# EAGLE design GDE043A2 FeatherWing (EAGLE 9.4.2)
COMPANY: ADAFRUIT INDUSTRIES; DRAWN: KTOWN; REV: B
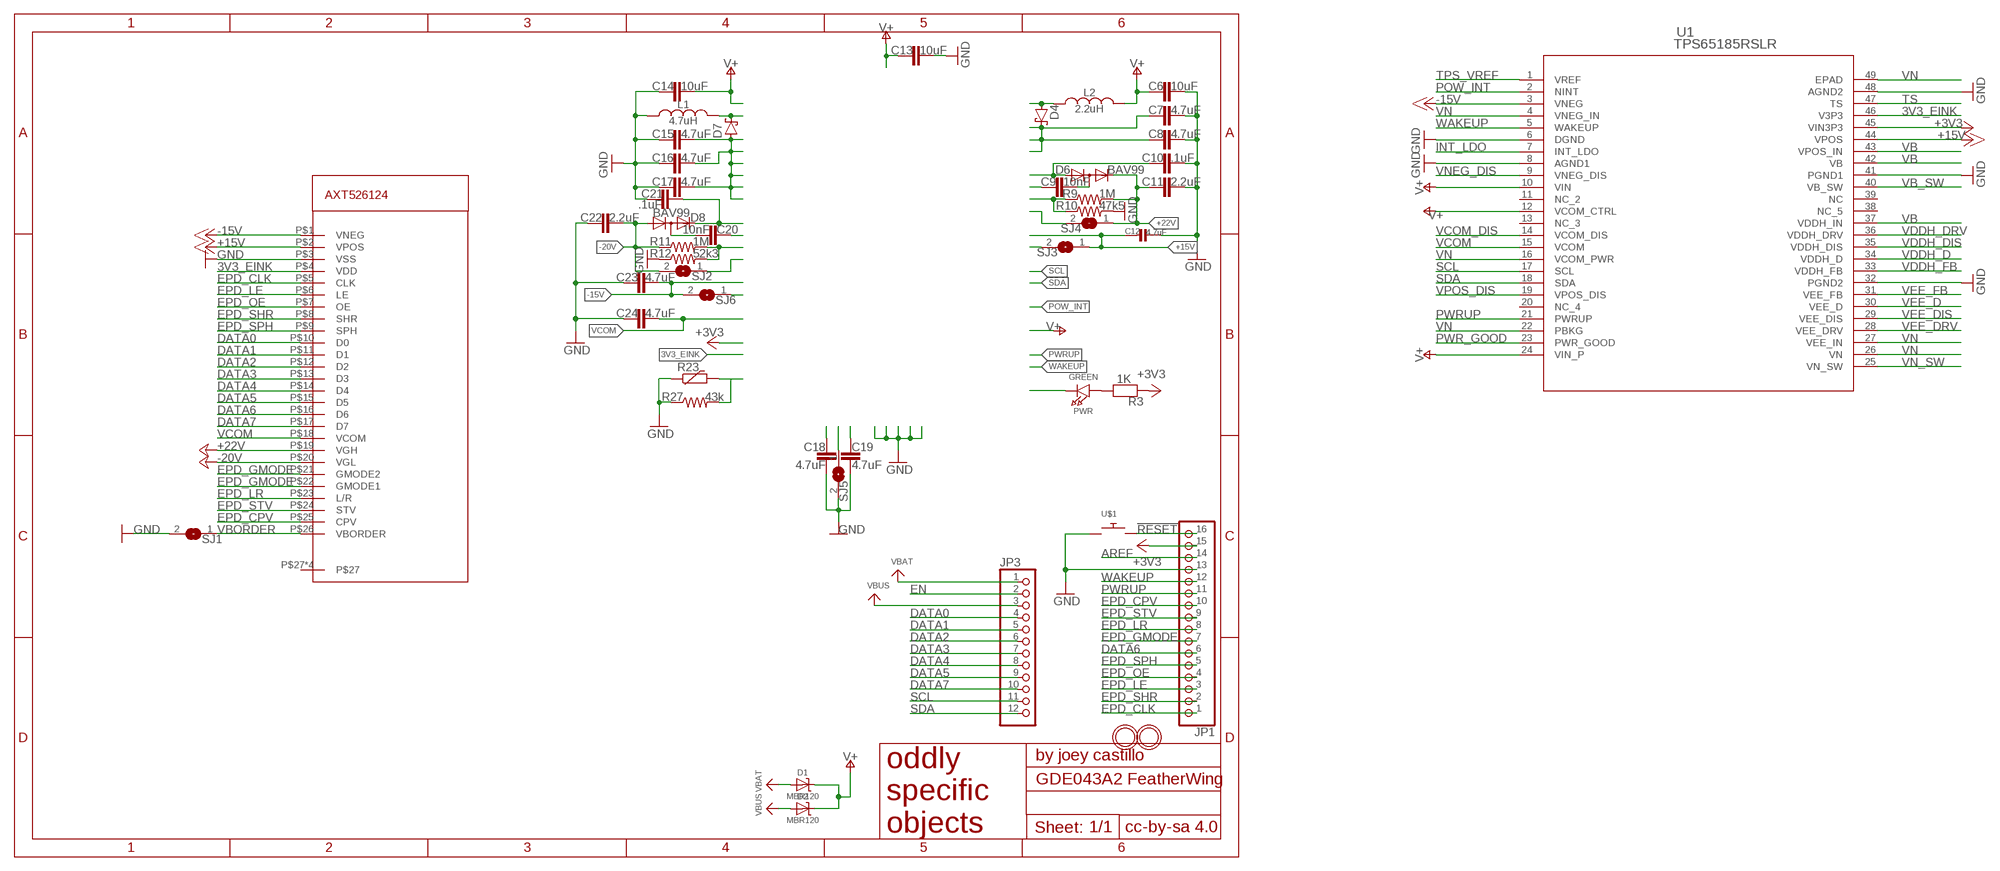
[diagram p0: schematic, sheet 1]

## Parts
C6  10uF  C-EUC0805K  [C0805K]
C7  4.7uF  C-EUC0805K  [C0805K]
C8  4.7uF  C-EUC0805K  [C0805K]
C9  10nF  C-EUC0805K  [C0805K]
C10  .1uF  C-EUC0805K  [C0805K]
C11  2.2uF  C-EUC0805K  [C0805K]
C12  4.7uF  CAP_CERAMIC0805_10MGAP  [0805_10MGAP]
C13  10uF  C-EUC0805K  [C0805K]
C14  10uF  C-EUC0805K  [C0805K]
C15  4.7uF  C-EUC0805K  [C0805K]
C16  4.7uF  C-EUC0805K  [C0805K]
C17  4.7uF  C-EUC0805K  [C0805K]
C18  4.7uF  C-EUC0805K  [C0805K]
C19  4.7uF  C-EUC0805K  [C0805K]
C20  10nF  C-EUC0805K  [C0805K]
C21  .1uF  C-EUC0805K  [C0805K]
C22  2.2uF  C-EUC0805K  [C0805K]
C23  4.7uF  C-EUC0805K  [C0805K]
C24  4.7uF  C-EUC0805K  [C0805K]
D1  MBR120  DIODE-SCHOTTKYSOD-123  [SOD-123]
D2  MBR120  DIODE-SCHOTTKYSOD-123  [SOD-123]
D4  MBR130T3G  [SOD123]
D6  BAV99  BAV199  [SOT23]
D7  MBR130T3G  [SOD123]
D8  BAV99  BAV199  [SOT23]
JP1  HEADER-1X16_MIN  [1X16_ROUND_MIN]
JP3  HEADER-1X12_MIN  [1X12_ROUND_MIN]
L1  4.7uH  NR4012  [NR4012]
L2  2.2uH  NR4012  [NR4012]
PWR  GREEN  LED0805_NOOUTLINE  [CHIPLED_0805_NOOUTLINE]
R3  1K  RESISTOR0805_NOOUTLINE  [0805-NO]
R9  1M  R-US_R0805  [R0805]
R10  47k5  R-US_R0805  [R0805]
R11  1M  R-US_R0805  [R0805]
R12  52k3  R-US_R0805  [R0805]
R23  R-EU_R0805  [R0805]
R27  43k  R-US_R0805  [R0805]
SJ1  SJ  [SJ]
SJ2  SJ  [SJ]
SJ3  SJ  [SJ]
SJ4  SJ  [SJ]
SJ5  SJ  [SJ]
SJ6  SJ  [SJ]
U1  TPS65185RSLR  [RSL48_4P4X4P4]
U$1  SPST_TACTILE_SWITCHTHRU-SECONDTRY  [MJTP1250-TRY2]
U$2  AXT526124  [AXT526124]
U$31  MOUNTINGHOLE2.5  [MOUNTINGHOLE_2.5_PLATED]
U$32  MOUNTINGHOLE2.5  [MOUNTINGHOLE_2.5_PLATED]

## Nets
3V3_EINK: U1.46(V3P3) U$2.P$4(VDD)
!RESET: JP1.16 U$1.P$2
+3V3 [power]: JP1.15 R3.1 U1.45(VIN3P3)
+15V: C12.2 SJ3.1 U1.44(VPOS) U$2.P$2(VPOS)
+22V: C11.1 D6.2(C) R9.2 SJ4.1 U$2.P$19(VGH)
-15V: C23.2 SJ6.2 U1.3(VNEG) U$2.P$1(VNEG)
-20V: C22.2 D8.1(A) R11.1 SJ2.2 U$2.P$20(VGL)
AREF: JP1.14
DATA0: JP3.4 U$2.P$10(D0)
DATA1: JP3.5 U$2.P$11(D1)
DATA2: JP3.6 U$2.P$12(D2)
DATA3: JP3.7 U$2.P$13(D3)
DATA4: JP3.8 U$2.P$14(D4)
DATA5: JP3.9 U$2.P$15(D5)
DATA6: JP1.6 U$2.P$16(D6)
DATA7: JP3.10 U$2.P$17(D7)
EN: JP3.2
EPD_CLK: JP1.1 U$2.P$5(CLK)
EPD_CPV: JP1.10 U$2.P$25(CPV)
EPD_GMODE: JP1.7 U$2.P$21(GMODE2) U$2.P$22(GMODE1)
EPD_LE: JP1.3 U$2.P$6(LE)
EPD_LR: JP1.8 U$2.P$23(L/R)
EPD_OE: JP1.4 U$2.P$7(OE)
EPD_SHR: JP1.2 U$2.P$8(SHR)
EPD_SPH: JP1.5 U$2.P$9(SPH)
EPD_STV: JP1.9 U$2.P$24(STV)
GND [gnd]: C6.2 C7.2 C8.2 C10.2 C11.2 C12.1 C13.2 C14.1 C15.1 C16.1 C17.1 C18.1 C19.1 C21.1 C22.1 C23.1 C24.1 JP1.13 L1.P$1 R10.2 R12.1 R23.1 R27.1 SJ1.2 SJ5.2 U1.6(DGND) U1.8(AGND1) U1.32(PGND2) U1.41(PGND1) U1.48(AGND2) U$1.P$1 U$2.P$3(VSS)
INT_LDO: C18.2 U1.7(INT_LDO)
N$2: PWR.A R3.2
N$21: C9.2 D6.3(AC)
N$23: C20.2 D8.3(AC)
POW_INT: U1.2(NINT)
PWR_GOOD: PWR.C U1.23(PWR_GOOD)
PWRUP: JP1.11 U1.21(PWRUP)
SCL: JP3.11 U1.17(SCL)
SDA: JP3.12 U1.18(SDA)
TPS_VREF: C19.2 U1.1(VREF)
TS: R23.2 R27.2 U1.47(TS)
V+ [power]: C6.1 C13.1 C14.2 D1.C D2.C L2.P$2 U1.10(VIN) U1.12(VCOM_CTRL) U1.24(VIN_P)
VB: C7.1 C8.1 D4.1(C) U1.37(VDDH_IN) U1.42(VB) U1.43(VPOS_IN)
VB_SW: D4.2(A) L2.P$1 U1.40(VB_SW)
VBAT [power]: D1.A JP3.1
VBORDER: SJ1.1 U$2.P$26(VBORDER)
VBUS [power]: D2.A JP3.3
VCOM: C24.2 U1.15(VCOM) U$2.P$18(VCOM)
VCOM_DIS: SJ5.1 U1.14(VCOM_DIS)
VDDH_D: C10.1 D6.1(A) U1.34(VDDH_D)
VDDH_DIS: SJ4.2 U1.35(VDDH_DIS)
VDDH_DRV: C9.1 U1.36(VDDH_DRV)
VDDH_FB: R9.1 R10.1 U1.33(VDDH_FB)
VEE_D: C21.2 D8.2(C) U1.30(VEE_D)
VEE_DIS: SJ2.1 U1.29(VEE_DIS)
VEE_DRV: C20.1 U1.28(VEE_DRV)
VEE_FB: R11.2 R12.2 U1.31(VEE_FB)
VN: C15.2 C16.2 C17.2 D7.2(A) U1.4(VNEG_IN) U1.16(VCOM_PWR) U1.22(PBKG) U1.26(VN) U1.27(VEE_IN) U1.49(EPAD)
VN_SW: D7.1(C) L1.P$2 U1.25(VN_SW)
VNEG_DIS: SJ6.1 U1.9(VNEG_DIS)
VPOS_DIS: SJ3.2 U1.19(VPOS_DIS)
WAKEUP: JP1.12 U1.5(WAKEUP)
Unconnected: U1.11(NC_2) U1.13(NC_3) U1.20(NC_4) U1.38(NC_5) U1.39(NC) U$2.P$27 U$2.P$28 U$2.P$29 U$2.P$30

## Library data of the parts
C6-C11 C13-C24 = rcl:C-EU: CAPACITOR, European symbol
C12 = microbuilder:CAP_CERAMIC: Ceramic Capacitors For new designs, use the packages preceded by an '_' character since they are more reliable: The following footprints should be used on most boards: _0402 - Standard footprint for regular board layouts _0603 - Standard footprint for regular board layouts _0805 - Standard footprint for regular board layouts _1206 - Standard footprint for regular board layouts For extremely tight-pitch boards where space is at a premium, the following 'micro-pitch' footprints can be used (smaller pads, no silkscreen outline, etc.): _0402MP - Micro-pitch footprint for very dense/compact boards _0603MP - Micro-pitch footprint for very dense/compact boards _0805MP - Micro-pitch footprint for very dense/compact boards _1206MP - Micro-pitch footprint for very dense/compact boards
D1 D2 = microbuilder:DIODE-SCHOTTKY
D4 D7 = aalectronics:MBR130T3G
D6 D8 = diode:BAV199: DIODE low-leakage double diode
JP1 = microbuilder:HEADER-1X16: PIN HEADER
JP3 = microbuilder:HEADER-1X12
L1 L2 = aalectronics:NR4012
PWR = microbuilder:LED: LED 0603 - 0603 Surface Mount Package 2mA: Green LED - Low Power (3.9mcd, 2ma, 1.7Vf) - Digikey: 475-2709-2-ND Orange LED - Low Power (9.8mcd, 2ma, 1.8Vf) - Digikey: 475-1194-2-ND Red LED - Low Power (5mcd, 2ma, 1.8Vf) - Digikey: 475-1195-2-ND Yellow LED - Low Power (7mcd, 2ma, 1.8Vf) - Digikey: 475-1196-2-ND 5mA: Blue LED - Low Power (17mcd, 5ma, 2.9Vf) - Digikey: LNJ937W8CRACT-ND 0805 - 0805 Surface Mount Package 2mA: Red LED (8.8mcd, 2mA, 1.8Vf, Clear) - Low Power [Digikey: 475-2510-1-ND] Green LED (5mcd, 2mA, 1.8Vf, Clear) - Low Power [Digikey: 475-2730-1-ND] Yellow LED (11.3mcd, 2mA, 1.8Vf, Clear) - Low Power [Digikey: 475-2555-1-ND] 20mA: Red LED (104mcd, 20mA, Diffused) - LS R976 [Digikey: 475-1278-6-ND] Red LED (12mcd, 20mA, 2.0Vf, Clear) - APT2012EC [Digikey: 754-1128-1-ND] Green LED (15mcd, 20mA, 2.2Vf, Clear) - APT2012GC [Digikey: 754-1131-1-ND] Orange LED (160mcd, 20mA, 2.1Vf, Clear) - APT2012SECK [Digikey: 754-1130-1-ND] 1206 - 1206 Surface Mount Package Green LED (26mcd, 20mA, Diffused) - LG N971 [Digikey: 475-1407-6-ND] Red LED (15mcd, 20mA, Diffused) - LH N974 [Digikey: 475-1416-6-ND] Cree - Cree High-Power Surface Mount LEDs XPEBWT-L1-0000-00D50 - White 111lm 350mA 2.9Vf 6200K 110° XTEAWT-00-0000-00000LEE3 - White 114lm 350mA 2.85Vf 5000K 115° Everlight - Everlight 45-21 Series Surface Mount LEDs 45-21/QK2C-B2832AC2CB2/2T - Warm White 2000mcd 20mA 3.25Vf 3050K 120° 45-21/LK2C-B38452C4CB2/2T - Nuetral White 2000mcd 20mA 3.25Vf 4150K 120° 45-21/LK2C-B50634C6CB2/2T - Cold White 2200mcd 20mA 3.25Vf 5650K 120° PLCC2 Reverse Mount LS T77K-J1L2-1-0-2-R18-Z - Red 11.25mcd 2mA 1.8Vf 630nm 120° LO T77K-L1M2-24-Z - Orange 19.6mcd 2mA 1.8Vf 606nm 120° LY T77K-K2M1-26-Z - Yellow 15.7mcd 2mA 1.8Vf 587nm 120°
R3 = microbuilder:RESISTOR: Resistors For new designs, use the packages preceded by an '_' character since they are more reliable: The following footprints should be used on most boards: _0402 - Standard footprint for regular board layouts _0603 - Standard footprint for regular board layouts _0805 - Standard footprint for regular board layouts _1206 - Standard footprint for regular board layouts For extremely tight-pitch boards where space is at a premium, the following 'micro-pitch' footprints can be used (smaller pads, no silkscreen outline, etc.): _0402MP - Micro-pitch footprint for very dense/compact boards _0603MP - Micro-pitch footprint for very dense/compact boards _0805MP - Micro-pitch footprint for very dense/compact boards _1206MP - Micro-pitch footprint for very dense/compact boards
R9-R12 R27 = rcl:R-US_: RESISTOR, American symbol
R23 = rcl:R-EU_: RESISTOR, European symbol
SJ1-SJ6 = jumper:SJ: SMD solder JUMPER
U1 = My Stuff:TPS65185RSLR; BUILT_BY: EMA_UL_Team; MANUFACTURER: Texas Instruments; MANUFACTURER_PART_NUMBER: TPS65185RSLR; VENDOR: Texas Instruments
U$1 = My Stuff:SPST_TACTILE_SWITCH
U$2 = My Stuff:AXT526124
U$31 U$32 = microbuilder:MOUNTINGHOLE: Mounting Hole For #2 screws (0.086"/2.18mm width, 0.094"/2.4mm hole) use 2.5mm; BOM: EXCLUDE

## Net classes
0 default: width 0.152 mm, drill 0.254 mm
1 power: width 0.279 mm, drill 0.305 mm
2 gnd: width 0.254 mm, drill 0.254 mm

## Board
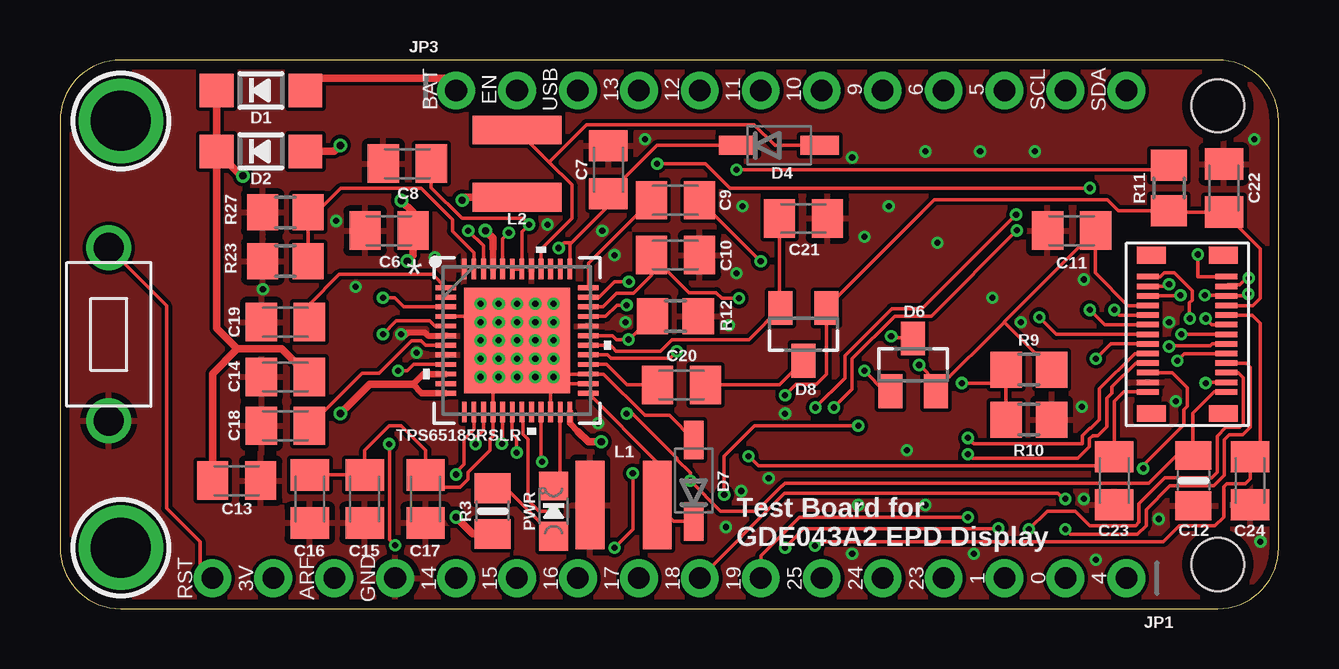
[diagram p1: board, top side]
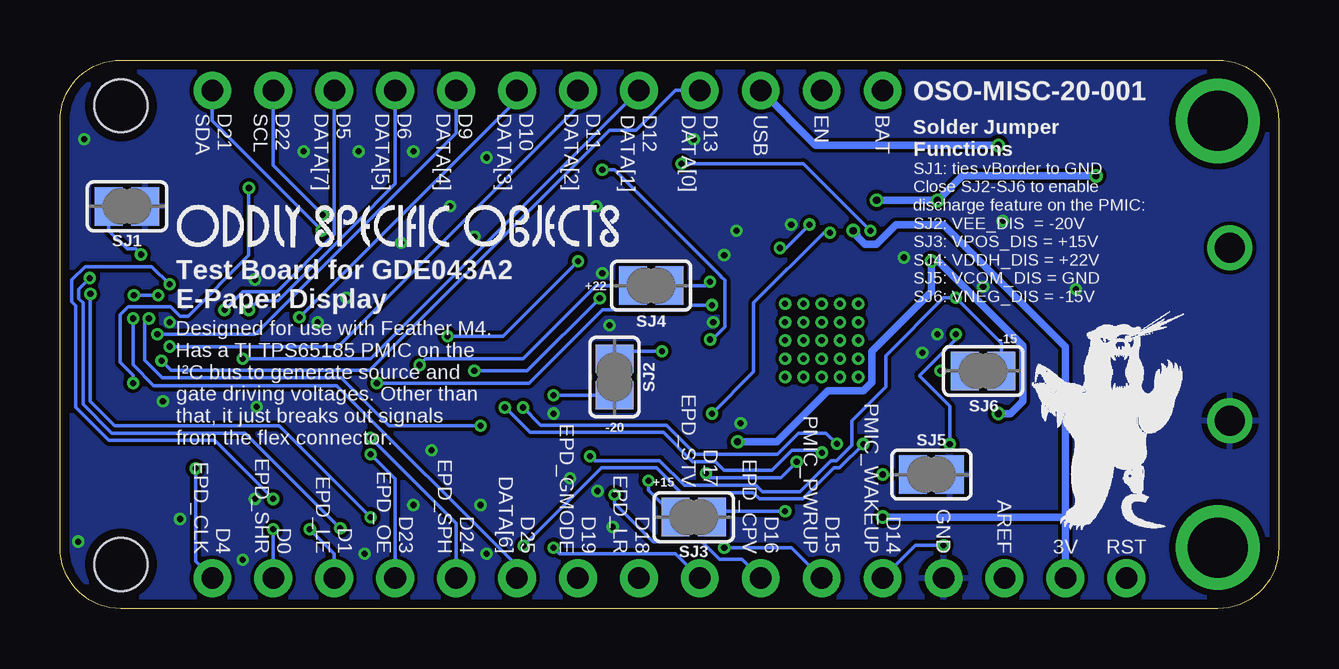
[diagram p2: board, bottom side, seen from below]

Size 50.8 x 22.86 mm. Coordinates in mm from the lower left corner, seen from the top.
Outline: 2.54,0 48.26,0 arc90 50.8,2.54 50.8,20.32 arc90 48.26,22.86 2.54,22.86 arc90 0,20.32 0,2.54 arc90 2.54,0
Copper layers (1*16): Top 0.035559375mm / dielectric 1.6mm / Bottom 0.035559375mm
Design rules "oshpark-2layer *": minimum track width 6mil, minimum drill 10mil, track to track 6mil, track to pad 6mil, pad to pad 6mil, via to via 6mil, smd to smd 6mil, copper to edge 15mil, drill to drill 6mil, minimum pad ring 5mil, minimum via ring 5mil, stop-mask expansion 2.5mil, vias tented up to drill 12mil, thermal gap 10mil
Holes 2.2 mm at 48.26,1.84 48.26,20.95

### Footprints (pad centres in the part's own frame; a part is rotated, then mirrored left to right if it is on the bottom)
C0805K = smd 1.3 x 1.6: 1 -1,0; 2 1,0
0805_10MGAP = smd 1.2 x 1.5: 1 -1.05,0; 2 1.05,0
SOD-123 = smd 1.4 x 1.4: A 1.85,0; C -1.85,0
SOD123 = smd 1.6 x 0.8: 1 -1.7,0; 2 1.7,0
SOT23 = smd 1 x 1.4: 1 -0.95,-1.1; 2 0.95,-1.1; 3 0,1.1
1X16_ROUND_MIN = drill 0.9 pad 1.575: 1 -19.05,0; 2 -16.51,0; 3 -13.97,0; 4 -11.43,0; 5 -8.89,0; 6 -6.35,0; 7 -3.81,0; 8 -1.27,0; 9 1.27,0; 10 3.81,0; 11 6.35,0; 12 8.89,0; 13 11.43,0; 14 13.97,0; 15 16.51,0; 16 19.05,0
1X12_ROUND_MIN = drill 0.9 pad 1.575: 1 -13.97,0; 2 -11.43,0; 3 -8.89,0; 4 -6.35,0; 5 -3.81,0; 6 -1.27,0; 7 1.27,0; 8 3.81,0; 9 6.35,0; 10 8.89,0; 11 11.43,0; 12 13.97,0
NR4012 = smd 1.2 x 3.7: P$1 -1.4,0; P$2 1.4,0
CHIPLED_0805_NOOUTLINE = smd 1.2 x 1.2: A 0,-1.05; C 0,1.05
0805-NO = smd 1.24 x 1.5: 1 -0.95,0; 2 0.95,0
R0805 = smd 1.3 x 1.5: 1 -0.95,0; 2 0.95,0
SJ = smd 1.168 x 1.6: 1 -0.762,0; 2 0.762,0
RSL48_4P4X4P4 = smd 0.85 x 0.2: 1 -2.975,2.2; 2 -2.975,1.8; 3 -2.975,1.4; 4 -2.975,1; 5 -2.975,0.6; 6 -2.975,0.2; 7 -2.975,-0.2; 8 -2.975,-0.6; 9 -2.975,-1; 10 -2.975,-1.4; 11 -2.975,-1.8; 12 -2.975,-2.2; 25 2.975,-2.2; 26 2.975,-1.8; 27 2.975,-1.4; 28 2.975,-1; 29 2.975,-0.6; 30 2.975,-0.2; 31 2.975,0.2; 32 2.975,0.6; 33 2.975,1; 34 2.975,1.4; 35 2.975,1.8; 36 2.975,2.2 | smd 0.2 x 0.85: 13 -2.2,-2.975; 14 -1.8,-2.975; 15 -1.4,-2.975; 16 -1,-2.975; 17 -0.6,-2.975; 18 -0.2,-2.975; 19 0.2,-2.975; 20 0.6,-2.975; 21 1,-2.975; 22 1.4,-2.975; 23 1.8,-2.975; 24 2.2,-2.975; 37 2.2,2.975; 38 1.8,2.975; 39 1.4,2.975; 40 1,2.975; 41 0.6,2.975; 42 0.2,2.975; 43 -0.2,2.975; 44 -0.6,2.975; 45 -1,2.975; 46 -1.4,2.975; 47 -1.8,2.975; 48 -2.2,2.975 | smd 4.4 x 4.4: 49 0,0 | drill 0.254 pad 0.508: P$1 -1.524,1.524; P$2 -0.762,1.524; P$3 0,1.524; P$4 0.762,1.524; P$5 1.524,1.524; P$6 -1.524,0.762; P$7 -0.762,0.762; P$8 0,0.762; P$9 0.762,0.762; P$10 1.524,0.762; P$11 -1.524,0; P$12 -0.762,0; P$13 0,0; P$14 0.762,0; P$15 1.524,0; P$16 -1.524,-0.762; P$17 -0.762,-0.762; P$18 0,-0.762; P$19 0.762,-0.762; P$20 1.524,-0.762; P$21 -1.524,-1.524; P$22 -0.762,-1.524; P$23 0,-1.524; P$24 0.762,-1.524; P$25 1.524,-1.524
MJTP1250-TRY2 = drill 1.25: P$1 -3.6,0; P$2 3.6,0
AXT526124 = smd 0.23 x 0.92: P$1 -2.4,1.65; P$2 -2.4,-1.63; P$3 -2,1.65; P$4 -2,-1.63; P$5 -1.6,1.65; P$6 -1.6,-1.63; P$7 -1.2,1.65; P$8 -1.2,-1.63; P$9 -0.8,1.65; P$10 -0.8,-1.63; P$11 -0.4,1.65; P$12 -0.4,-1.63; P$13 0,1.65; P$14 0,-1.63; P$15 0.4,1.65; P$16 0.4,-1.63; P$17 0.8,1.65; P$18 0.8,-1.63; P$19 1.2,1.65; P$20 1.2,-1.63; P$21 1.6,1.65; P$22 1.6,-1.63; P$23 2,1.65; P$24 2,-1.63; P$25 2.4,1.65; P$26 2.4,-1.63 | smd 0.7 x 1.2: P$27 -3.3,1.5; P$28 -3.3,-1.5; P$29 3.3,1.5; P$30 3.3,-1.5
MOUNTINGHOLE_2.5_PLATED = drill 2.5 pad 3.2: P$1 0,0

### Placement (x,y rotation side)
C6  13.72,15.75 180 top
C7  22.86,18.29 90 top
C8  14.48,18.54 180 top
C9  25.65,17.02 0 top
C10  25.65,14.73 0 top
C11  42.16,15.75 180 top
C12  47.24,5.33 90 top
C13  7.37,5.33 0 top
C14  9.4,9.65 0 top
C15  12.7,4.57 90 top
C16  10.41,4.57 90 top
C17  15.24,4.57 90 top
C18  9.4,7.62 0 top
C19  9.4,11.94 0 top
C20  25.91,9.32 0 top
C21  30.99,16.26 180 top
C22  48.51,17.53 270 top
C23  43.94,5.33 90 top
C24  49.61,5.33 90 top
D1  8.38,21.59 0 top
D2  8.38,19.05 0 top
D4  29.97,19.3 0 top
D6  35.56,10.16 0 top
D7  26.42,5.33 90 top
D8  30.99,11.43 180 top
JP1  25.4,1.27 180 top
JP3  30.48,21.59 0 top
L1  23.5,4.32 0 top
L2  19.05,18.54 270 top
PWR  20.57,4.06 0 top
R3  18.03,4.06 90 top
R9  40.39,9.96 0 top
R10  40.39,7.87 0 top
R11  46.23,17.53 90 top
R12  25.65,12.19 180 top
R23  9.4,14.48 0 top
R27  9.4,16.51 0 top
SJ1  48.01,16.76 0 bottom
SJ2  27.69,9.65 270 bottom
SJ3  24.38,3.81 0 bottom
SJ4  26.16,13.46 0 bottom
SJ5  14.48,5.59 0 bottom
SJ6  12.32,9.91 0 bottom
U1  19.05,11.18 0 top
U$1  2.03,11.43 90 top
U$2  46.99,11.43 90 top
U$4  [OSO_WORDMARK_ONELINE_725MIL_1000DPI]  45.97,14.99 0 bottom
U$7  [OSO_BEAR_250X360MIL_1000DPI]  7.11,7.87 0 bottom
U$31  2.54,20.32 270 top
U$32  2.54,2.54 270 top

### Tracks (layer width: path | path; a pad name or v marks a point on that pad's centre or on a via)
3V3_EINK  (via drill 0.25)
  Top 0.152: U$2.P$4 47.78,9.43 v47.75,9.4 | v42.93,17.53 27.92,17.53 26.9,18.54 v24.89,18.54 | U1.46 17.65,15.12 v17.02,15.75
  Bottom 0.152: v47.75,9.4 47.75,9.73 48.28,10.26 48.28,12.24 47.95,12.57 46.18,12.57 45.8,12.19 45.47,12.19 42.93,14.73 v42.93,17.53 | v24.89,18.54 19.81,18.54 v17.02,15.75
!RESET
  Top 0.152: JP1.16 5.84,1.78 5.84,2.79 4.45,4.19 4.45,12.62 U$1.P$2
+3V3  (via drill 0.3)
  Top 0.279: U1.45 18.05,14.99
  Top 0.305: R3.1 17.21,3.11 v16.51,3.81 | 18.05,14.99 18.05,15.43 v17.74,15.75
  Bottom 0.305: v17.74,15.75 17.58,15.59 17.58,15.52 17.25,15.19 16.76,15.19 15.95,16 13.97,16 8.89,10.92 8.89,3.81 | 8.89,3.81 JP1.15 | v16.51,3.81 8.89,3.81
+15V  (via drill 0.25)
  Top 0.152: U$2.P$2 48.12,9.03 47.23,8.14 47.23,6.37 | C12.2 47.23,6.37 | 47.23,6.37 47.19,6.33 46.48,6.33 45.38,5.23 30.23,5.23 30.1,5.11 30.07,5.11 29.03,4.06 27.54,4.06 v26.27,5.33 26.27,5.66 25.72,6.2 25.72,6.26 23.86,8.13 v23.62,8.13 | U1.44 18.45,15.4 v18.71,15.66
  Bottom 0.152: v18.71,15.66 18.96,15.66 21.88,12.74 21.88,9.87 v23.62,8.13 | v26.27,5.33 26.27,4.93 SJ3.1
+22V  (via drill 0.25)
  Top 0.152: 39.35,11.94 39.36,11.95 C11.1 43.16,13.99 44.52,12.63 U$2.P$19 | 39.35,11.94 36.51,9.09 D6.2 36.51,9.46 v35.81,10.15 | 39.35,11.94 R9.2
  Bottom 0.152: SJ4.1 28.45,13.46 31.5,10.41 35.56,10.41 v35.81,10.15
-15V  (via drill 0.25)
  Top 0.152: v28.7,6.35 28.73,6.35 29.12,5.95 43.56,5.95 C23.2 43.94,8.64 44.34,9.03 U$2.P$1 | v13.46,12.95 13.95,12.95 14.33,12.58 U1.3
  Bottom 0.152: SJ6.2 11.56,11.05 v13.46,12.95 13.97,12.95 16.38,10.54 16.38,9.24 17.8,7.82 17.8,6.81 18.43,6.17 18.67,6.17 19.96,4.88 21.52,4.88 21.78,5.14 24.78,5.14 25.81,6.17 28.52,6.17 v28.7,6.35
-20V  (via drill 0.25)
  Top 0.152: U$2.P$20 49.73,12.63 50.04,12.94 50.04,15 C22.2 46.28,16.53 R11.1 44.11,16.58 43.66,17.03 36.44,17.03 D8.1 31.94,9.76 31.53,9.35 30.68,9.35 v30.23,8.89
  Bottom 0.152: SJ2.2 v30.23,8.89
DATA0  (via drill 0.25)
  Top 0.152: U$2.P$10 46.87,10.63 v46.57,10.33
  Bottom 0.152: v46.57,10.33 v46.57,10.32 46.17,9.93 37.9,9.93 27.89,19.94 26.8,19.94 25.15,21.59 JP3.4
DATA1  (via drill 0.25)
  Top 0.152: v43.18,10.41 43.8,11.03 U$2.P$11
  Bottom 0.152: JP3.5 37.85,10.41 v43.18,10.41
DATA2  (via drill 0.25)
  Top 0.152: v46.23,10.92 46.25,10.95 47.95,10.95 48.03,11.03 U$2.P$12
  Bottom 0.152: v46.23,10.92 39.2,10.92 29.21,20.91 JP3.6
DATA3  (via drill 0.25)
  Top 0.152: U$2.P$13 41.53,11.43 v40.82,12.14
  Bottom 0.152: v40.82,12.14 31.75,21.21 JP3.7
DATA4  (via drill 0.25)
  Top 0.152: v46.74,11.43 U$2.P$14
  Bottom 0.152: JP3.8 34.29,19.81 42.67,11.43 v46.74,11.43
DATA5  (via drill 0.25)
  Top 0.152: U$2.P$15 43.54,11.83 v42.93,12.45
  Bottom 0.152: v42.93,12.45 42.55,12.83 41.71,12.83 38.57,15.96 36.83,17.7 JP3.9
DATA6  (via drill 0.25)
  Top 0.152: U$2.P$16 48.01,11.83 v47.75,12.09
  Bottom 0.152: JP1.6 31.75,1.78 39.27,9.3 46.89,9.3 47.75,10.16 v47.75,12.09
DATA7  (via drill 0.25)
  Top 0.152: U$2.P$17 44.16,12.23 v43.94,12.45
  Bottom 0.152: v43.94,12.45 43.18,13.21 41.76,13.21 39.37,15.59 JP3.10
EPD_CLK  (via drill 0.25)
  Top 0.152: U$2.P$5 46.35,9.83 46.99,9.2 46.99,8.44 46.84,8.28 46.84,7.66 45.15,5.97 v45.15,5.84
  Bottom 0.152: JP1.1 45.15,1.97 v45.15,5.84
EPD_CPV  (via drill 0.25)
  Top 0.152: v27.69,4.75 27.69,6.35 28.96,7.62 v33.27,7.62 | v47.09,12.09 v47.08,12.09 47.08,12.75 47.19,12.86 47.19,13.26 46.45,13.99 46.03,13.99 45.86,13.83 U$2.P$25
  Bottom 0.152: v33.27,7.62 37.08,7.62 39.09,9.63 46.55,9.63 47.27,10.35 47.27,11.91 v47.09,12.09 | JP1.10 22.38,2.06 23.31,2.06 24.04,2.78 26.08,2.78 27.69,4.39 v27.69,4.75
EPD_GMODE  (via drill 0.25)
  Top 0.152: v49.53,13.11 49.45,13.03 U$2.P$22 48.59,13.06 v47.72,13.06 | JP1.7 29.21,2.21 30.81,3.81 v37.85,3.81 | U$2.P$21 46.68,13.03 v46.7,13.06
  Bottom 0.152: v49.53,13.11 49.53,8.64 48.51,7.62 41.66,7.62 v37.85,3.81 | v46.7,13.06 v47.72,13.06
EPD_LE  (via drill 0.25)
  Top 0.152: U$2.P$6 49.12,9.83 49.32,9.63 49.32,7.68 49.19,7.55 48.6,7.55 48.23,7.19 48.23,5.68 48.01,5.46 46.05,5.46 44.97,4.38 44.97,3.59 44.84,3.46 42.93,3.46 42.32,4.06 41.15,4.06 v40.39,3.3
  Bottom 0.152: v40.39,3.3 39.37,2.29 JP1.3
EPD_LR  (via drill 0.25)
  Top 0.152: U$2.P$23 46.15,13.43 v46.23,13.51 | v41.91,4.57 41.83,4.57 41.6,4.8 30.2,4.8 JP1.8
  Bottom 0.152: v46.23,13.51 46.97,14.26 49.76,14.26 50.31,13.7 50.31,12.79 50.14,12.61 50.14,8.38 48.77,7.01 44.35,7.01 v41.91,4.57
EPD_OE  (via drill 0.25)
  Top 0.152: U$2.P$7 44.84,10.23 43.85,9.24 43.85,8.97 43.64,8.76 43.64,7.58 43.27,7.21 43.05,7.21 42.91,7.08 42.91,6.75 42.42,6.26 38.02,6.26 v37.85,6.44
  Bottom 0.152: JP1.4 36.83,5.42 v37.85,6.44
EPD_SHR  (via drill 0.25)
  Top 0.152: U$2.P$8 49.46,10.23 49.62,10.07 49.62,7.56 49.31,7.25 48.75,7.25 48.54,7.04 48.54,5.55 48.1,5.11 46.26,5.11 45.27,4.13 45.27,3.46 44.91,3.1 42.11,3.1 v41.91,3.3
  Bottom 0.152: v41.91,3.3 JP1.2
EPD_SPH  (via drill 0.25)
  Top 0.152: U$2.P$9 44.81,10.63 43.33,9.15 43.33,7.87 42.98,7.52 42.92,7.52 42.61,7.21 42.61,6.88 38.09,6.88 38.05,6.92 38.04,6.92 v37.85,7.11
  Bottom 0.152: v37.85,7.11 37.65,6.92 34.29,3.56 JP1.5
EPD_STV  (via drill 0.25)
  Top 0.152: U$2.P$24 48.68,13.49 49.17,13.49 49.46,13.77 v49.55,13.77 | v39.12,3.35 39.09,3.35 39.06,3.33 30.99,3.33 30.73,3.07 30.73,3.05 v30.23,2.54
  Bottom 0.152: v49.55,13.77 50.01,13.31 50.01,12.91 49.84,12.74 49.84,8.51 48.64,7.32 43.08,7.32 v39.12,3.35 | JP1.9 25.15,2.29 29.97,2.29 v30.23,2.54
GND  (via drill 0.25)
  Top 0.254: v14.22,11.43 14.28,11.38 14.37,11.38 14.51,11.51 15.21,11.51 15.34,11.38 U1.6
  other vias: 35.31,6.6 33.27,4.32 28.45,16.76 24.38,19.56 12.32,13.41 15.62,14.63 42.6,8.41 33.53,15.49 30.23,8.13 28.19,13.97 46.23,11.94 42.67,13.72 40.06,11.94 38.86,12.95 27.89,11.81 50.04,2.79 11.51,16.15 22.43,7.72 29.54,5.44 28.4,4.9 27.76,3.4 46.51,8.64 23.11,14.73 22.61,15.75 23.57,11.94 38.1,2.29 43.18,2.03 34.54,16.76 49.78,19.56 33.02,18.8 42.67,4.57 45.8,3.73 8.46,13.31 36.58,15.24 36.07,19.05 38.35,19.05 40.64,19.05 36.07,4.32 33.02,2.29 20.32,16 14.86,10.67
  pour Top: -0.25,22.86 -0.25,0 50.93,0 50.93,22.86
  pour Bottom: 0,0 51.18,0 51.18,22.86 0,22.86
INT_LDO
  Top 0.152: C18.2 12.59,9.81 13.31,9.81 14.65,11.15 15.06,11.15 15.24,10.98 U1.7
N$2
  Top 0.152: PWR.A 20.57,3.03 18.59,5.01 R3.2
N$21  (via drill 0.25)
  Top 0.152: C9.2 29.19,14.48 v29.21,14.48 | D6.3 35.48,11.26 35.46,11.28 34.72,11.28 v34.65,11.35
  Bottom 0.152: v29.21,14.48 32.33,11.35 v34.65,11.35
N$23
  Top 0.152: D8.3 29.98,9.32 C20.2
PWR_GOOD
  Top 0.152: U1.23 20.85,5.39 PWR.C
PWRUP  (via drill 0.25)
  Top 0.152: v23.88,5.64 23.88,3.3 v23.11,2.54 | U1.21 20.05,6.16 v20.09,6.12
  Bottom 0.152: v23.88,5.64 23.7,5.46 20.75,5.46 v20.09,6.12 | v23.11,2.54 20.32,2.54 JP1.11
SCL  (via drill 0.25)
  Top 0.152: v39.85,16.42 35.93,12.5 34.67,12.5 32.72,10.54 32.72,9.6 v31.5,8.38 | U1.17 18.45,6.9 v18.42,6.87
  Bottom 0.152: JP3.11 41.91,18.48 v39.85,16.42 | v31.5,8.38 30.76,7.64 25.53,7.64 24.31,6.43 20.9,6.43 20.01,7.32 18.86,7.32 v18.42,6.87
SDA  (via drill 0.25)
  Top 0.152: v32.26,8.38 33.02,9.14 33.02,10.41 34.8,12.19 36.32,12.19 v39.89,15.76 | v19.04,6.5 19.04,7.1 18.85,7.29 U1.18
  Bottom 0.152: v32.26,8.38 31.22,7.34 25.65,7.34 24.43,6.12 23.47,6.12 23.12,5.77 21.13,5.77 20.29,6.6 19.14,6.6 v19.04,6.5 | v39.89,15.76 44.46,20.33 JP3.12
TPS_VREF
  Top 0.152: C19.2 10.4,12.68 11.64,13.93 15.53,13.93 U1.1
TS
  Top 0.152: R23.2 R27.2 10.69,16.51 11.69,17.51 15.05,17.51 16.36,16.21 16.36,15.73 17.25,14.83 U1.47
V+  (via drill 0.3)
  Top 0.279: U1.10 15.14,9.78 14.71,9.35 15.08,8.98 U1.12 | U1.24 21.25,7.73 21.6,7.38
  Top 0.305: D1.C D2.C | v14.22,17 14.72,16.51 C6.1 14.72,14.72 v14.48,14.48 | v7.62,18.03 7.55,18.03 D2.C | L2.P$2 16.89,17.14 v16.76,17.02 | C14.2 9.23,10.82 7.39,10.82 | 7.39,10.82 6.37,9.79 C13.1 | D2.C 6.53,11.68 7.39,10.82 | v22.56,6.96 22.02,6.96 21.6,7.38 | v11.68,8.13 12.9,9.35 14.71,9.35
  Bottom 0.305: v7.62,18.03 13.2,18.03 v14.22,17 14.24,17.02 v16.76,17.02 | v22.56,6.96 20.91,6.96 18.79,9.08 17.3,9.08 16.95,9.43 16.95,10.73 14.48,13.21 v14.48,14.48 14.2,14.48 10.67,10.95 10.67,8.64 11.18,8.13 v11.68,8.13
VB  (via drill 0.25)
  Top 0.152: C8.1 15.48,17.54 16.76,16.26 19.3,16.26 v19.56,16 19.25,15.69 19.25,15.55 19.25,15.49 U1.42 U1.43 | D4.1 24.88,19.3 C7.1 22.86,16.78 21.33,15.25 | U1.37 21.25,15.17 21.33,15.25 | 21.33,15.25 21.01,15.25 v20.79,15.03
  Bottom 0.152: v20.79,15.03 20.53,15.03 v19.56,16
VB_SW
  Top 0.152: L2.P$1 20.39,18.61 | 20.39,18.61 21.34,17.66 21.34,16.26 20.05,14.97 U1.40 | D4.2 29.8,19.3 28.93,20.17 21.95,20.17 20.39,18.61
VBAT
  Top 0.305: D1.A 10.74,22.1 16,22.1 JP3.1
VBORDER  (via drill 0.25)
  Top 0.152: U$2.P$26 47.42,13.83 v47.42,14.76
  Bottom 0.152: v47.42,14.76 47.65,14.99 48.01,14.99 48.77,15.75 SJ1.1
VBUS  (via drill 0.3)
  Top 0.305: v11.68,19.3 11.43,19.05 D2.A
  Bottom 0.305: JP3.3 19.3,19.3 v11.68,19.3
VCOM  (via drill 0.25)
  Top 0.152: U$2.P$18 49.7,12.23 50.04,11.89 50.04,6.77 C24.2 49.61,5.41 49.41,5.21 48.63,5.21 48.5,5.08 48.5,3.82 48.14,3.46 46.65,3.46 45.99,2.79 31.65,2.79 v31.47,2.62 | v17.32,6.86 17.3,6.88 17.3,7.09 17.65,7.44 U1.15
  Bottom 0.152: v17.32,6.86 18.31,5.87 18.54,5.87 19.84,4.57 21.64,4.57 21.91,4.84 24.91,4.84 25.93,5.87 28.22,5.87 v31.47,2.62
VCOM_DIS  (via drill 0.25)
  Top 0.152: v16.51,5.59 16.51,5.69 16.71,5.89 16.8,5.98 16.84,6.01 16.84,7.06 17.25,7.47 U1.14
  Bottom 0.152: v16.51,5.59 SJ5.1
VDDH_D  (via drill 0.25)
  Top 0.152: v28.3,12.93 27.59,12.93 27.35,13.17 26.21,13.17 C10.1 24.65,13.88 23.91,13.14 23.21,13.14 22.64,12.58 U1.34 | v33.53,9.91 34.37,9.06 D6.1
  Bottom 0.152: v28.3,12.93 31.32,9.91 v33.53,9.91
VDDH_DIS  (via drill 0.25)
  Top 0.152: v23.71,13.62 23.11,13.62 22.68,13.19 22.68,13.18 22.47,12.98 U1.35
  Bottom 0.152: v23.71,13.62 23.88,13.46 SJ4.2
VDDH_DRV
  Top 0.152: U1.36 22.02,14.39 C9.1
VDDH_FB  (via drill 0.25)
  Top 0.152: R10.1 R9.1 38.88,9.4 v37.59,9.4 | v23.62,12.65 23.22,12.65 22.74,12.18 U1.33
  Bottom 0.152: v37.59,9.4 31.24,9.4 28.19,12.45 27.62,12.45 27.6,12.43 24.72,12.43 24.5,12.65 v23.62,12.65
VEE_D
  Top 0.152: C21.2 29.99,12.58 D8.2 28.72,11.21 25.51,11.21 25.03,10.73 23.18,10.73 23.05,10.86 22.99,10.93 22.94,10.98 U1.30
VEE_DIS  (via drill 0.25)
  Top 0.152: v25.71,10.73 25.71,10.7 25.43,10.43 22.96,10.43 22.82,10.58 U1.29
  Bottom 0.152: v25.71,10.73 27.37,10.73 SJ2.1
VEE_DRV
  Top 0.152: U1.28 22.78,10.18 23.64,9.32 C20.1
VEE_FB  (via drill 0.25)
  Top 0.152: R11.2 45.97,18.22 45.91,18.22 45.84,18.29 v28.19,18.29 | R12.2 23.73,11.21 v23.7,11.21 23.19,11.21 23.03,11.38 U1.31
  Bottom 0.152: v28.19,18.29 27.69,18.29 23.24,13.84 23.09,13.68 23.09,11.74 23.61,11.21 v23.7,11.21
VN
  Top 0.152: D7.2 25.4,8.05 24.39,8.05 22.66,9.78 U1.27 20.58,9.78 20.45,9.91 | U1.49 19.81,11.18 20.45,10.54 20.45,9.91 | U1.49 19.05,10.18 18.05,9.18 U1.16 18.05,7.18 17.94,7.07 17.94,6.61 17,5.68 17,5.4 16.67,5.06 15.75,5.06 C17.2 15.24,6.6 14.22,7.62 13.72,7.62 12.7,6.6 C15.2 C16.2 | U1.4 17.29,12.18 18.29,11.18 U1.49 | U1.22 20.45,9.65 | 20.45,9.65 20.45,9.91 | U1.26 20.73,9.38 20.45,9.65
VN_SW
  Top 0.152: D7.1 25.58,3.63 L1.P$2 24.89,6.11 U1.25
VNEG_DIS  (via drill 0.25)
  Top 0.152: v14.1,9.91 14.47,9.91 14.74,10.18 U1.9
  Bottom 0.152: v14.1,9.91 SJ6.1
VPOS_DIS  (via drill 0.25)
  Top 0.152: v20.57,4.06 19.97,4.06 19.52,4.52 19.52,7.05 19.3,7.27 19.3,8.15 U1.19
  Bottom 0.152: SJ3.2 23.37,4.06 v20.57,4.06
WAKEUP  (via drill 0.25)
  Top 0.152: v13.97,2.64 13.74,2.87 13.74,6.83 v13.72,6.86 | U1.5 15.63,11.78 15.41,11.99 14.02,11.99 v13.46,11.43
  Bottom 0.152: JP1.12 15.14,2.64 v13.97,2.64 | v13.72,6.86 13.72,8.44 14.96,9.68 14.96,9.73 13.46,11.23 v13.46,11.43

### Text on the board
tPlace: BAT | EN | USB | 13 | 12 | 11 | 10 | 9 | 6 | 5 | SCL | SDA | Test Board for / GDE043A2 EPD Display | RST | 3V | ARF | GND | 14 | 15 | 16 | 17 | 18 | 19 | 25 | 24 | 23 | 1 | 0 | 4
bPlace: OSO-MISC-20-001 | BAT | EN | USB | D13 / DATA[0] | D12 / DATA[1] | D11 / DATA[2] | D10 / DATA[3] | D9 / DATA[4] | D6 / DATA[5] | D5 / DATA[7] | D22 / SCL | D21 / SDA | Solder Jumper / Functions | SJ1: ties vBorder to GND / Close SJ2-SJ6 to enable / discharge feature on the PMIC: / SJ2: VEE_DIS = -20V / SJ3: VPOS_DIS = +15V / SJ4: VDDH_DIS = +22V / SJ5: VCOM_DIS = GND / SJ6: VNEG_DIS = -15V | Test Board for GDE043A2 / E-Paper Display | +22 | Designed for use with Feather M4. / Has a TI TPS65185 PMIC on the / I²C bus to generate source and / gate driving voltages. Other than / that, it just breaks out signals / from the flex connector. | -15 | -20 | D17 / EPD_STV | +15 | RST | 3V | AREF | GND | D14 / PMIC_WAKEUP | D15 / PMIC_PWRUP | D16 / EPD_CPV | D18 / EPD_LR | D19 / EPD_GMODE | D25 / DATA[6] | D24 / EPD_SPH | D23 / EPD_OE | D1 / EPD_LE | D0 / EPD_SHR | D4 / EPD_CLK